# EAGLE schematic Esquemático v2 v3 (EAGLE 9.7.0)
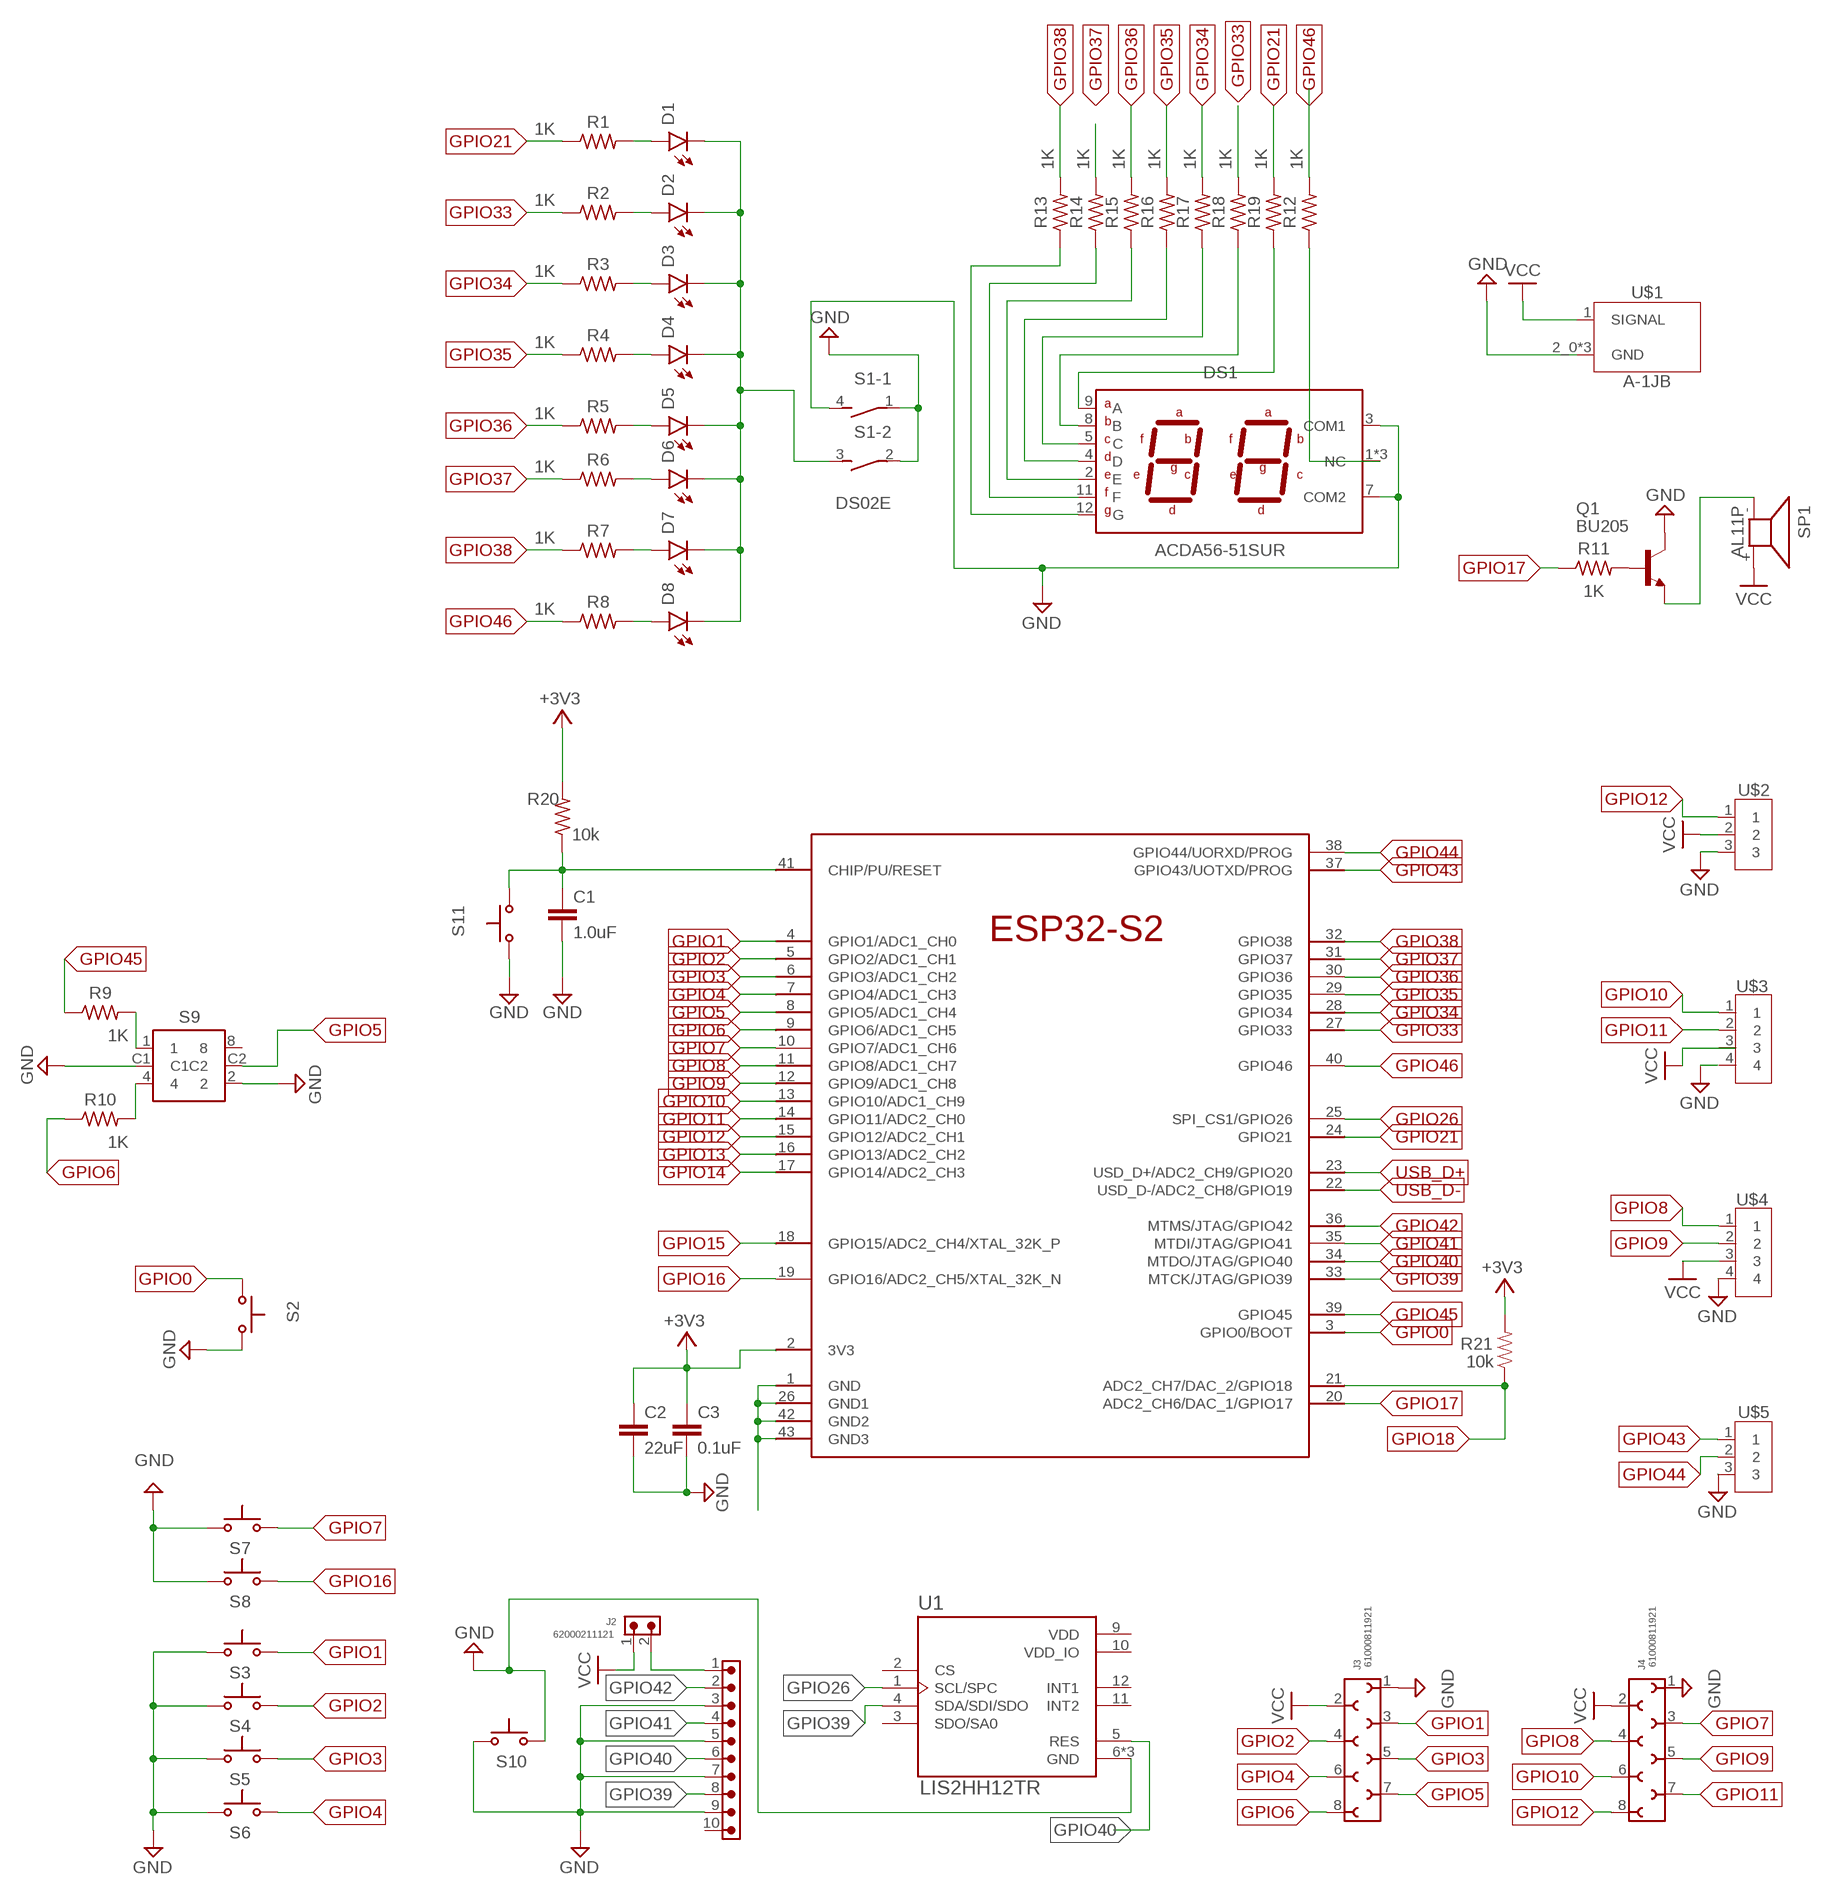
[diagram p0: schematic, sheet 1]

## Parts
C1  1.0uF  1.0UF-0805-25V-10%  [0805]
C2  22uF  22UF-1210-16V-20%  [1210]
C3  0.1uF  0.1UF-0603-100V-10%  [0603]
D1  LED_RADIAL  [LEDRD254W60D565H860B_G]
D2  LED_RADIAL  [LEDRD254W60D565H860B_G]
D3  LED_RADIAL  [LEDRD254W60D565H860B_G]
D4  LED_RADIAL  [LEDRD254W60D565H860B_G]
D5  LED_RADIAL  [LEDRD254W60D565H860B_G]
D6  LED_RADIAL  [LEDRD254W60D565H860B_G]
D7  LED_RADIAL  [LEDRD254W60D565H860B_G]
D8  LED_RADIAL  [LEDRD254W60D565H860B_G]
DS1  ACDA56-51SUR  [ACDA56-51SURKWA]
J1  61901019521  61901019521  [61901019521]
J2  62000211121  6200XX11121_62000211121  [62000211121]
J3  61000811921  6100XX11921_61000811921  [61000811921]
J4  61000811921  6100XX11921_61000811921  [61000811921]
Q1  BU205  [TO3]
R1  1K  R-US_AXIAL-7.2MM-PITCH  [RESAD724W46L381D178B]
R2  1K  R-US_AXIAL-7.2MM-PITCH  [RESAD724W46L381D178B]
R3  1K  R-US_AXIAL-7.2MM-PITCH  [RESAD724W46L381D178B]
R4  1K  R-US_AXIAL-7.2MM-PITCH  [RESAD724W46L381D178B]
R5  1K  R-US_AXIAL-7.2MM-PITCH  [RESAD724W46L381D178B]
R6  1K  R-US_AXIAL-7.2MM-PITCH  [RESAD724W46L381D178B]
R7  1K  R-US_AXIAL-7.2MM-PITCH  [RESAD724W46L381D178B]
R8  1K  R-US_AXIAL-7.2MM-PITCH  [RESAD724W46L381D178B]
R9  1K  R-US_AXIAL-7.2MM-PITCH  [RESAD724W46L381D178B]
R10  1K  R-US_AXIAL-7.2MM-PITCH  [RESAD724W46L381D178B]
R11  1K  R-US_AXIAL-7.2MM-PITCH  [RESAD724W46L381D178B]
R12  1K  R-US_AXIAL-7.2MM-PITCH  [RESAD724W46L381D178B]
R13  1K  R-US_AXIAL-7.2MM-PITCH  [RESAD724W46L381D178B]
R14  1K  R-US_AXIAL-7.2MM-PITCH  [RESAD724W46L381D178B]
R15  1K  R-US_AXIAL-7.2MM-PITCH  [RESAD724W46L381D178B]
R16  1K  R-US_AXIAL-7.2MM-PITCH  [RESAD724W46L381D178B]
R17  1K  R-US_AXIAL-7.2MM-PITCH  [RESAD724W46L381D178B]
R18  1K  R-US_AXIAL-7.2MM-PITCH  [RESAD724W46L381D178B]
R19  1K  R-US_AXIAL-7.2MM-PITCH  [RESAD724W46L381D178B]
R20  10k  R-US_AXIAL-7.2MM-PITCH  [RESAD724W46L381D178B]
R21  10k  10KOHM-0603-1/10W-1%  [0603]
S1  DS02E  [DS-02]
S2  SWITCH-OMRON_B3U-1000P  [SWITCH-OMRON_B3U-1000P]
S3  SWITCH-OMRON_B3U-1000P  [SWITCH-OMRON_B3U-1000P]
S4  SWITCH-OMRON_B3U-1000P  [SWITCH-OMRON_B3U-1000P]
S5  SWITCH-OMRON_B3U-1000P  [SWITCH-OMRON_B3U-1000P]
S6  SWITCH-OMRON_B3U-1000P  [SWITCH-OMRON_B3U-1000P]
S7  SWITCH-OMRON_B3U-1000P  [SWITCH-OMRON_B3U-1000P]
S8  SWITCH-OMRON_B3U-1000P  [SWITCH-OMRON_B3U-1000P]
S9  428521420911  [42852142091X_10POS]
S10  SWITCH-OMRON_B3U-1000P  [SWITCH-OMRON_B3U-1000P]
S11  SWITCH-OMRON_B3U-1000P  [SWITCH-OMRON_B3U-1000P]
SP1  AL11P  [AL11P]
U1  LIS2HH12TR  [LGA-12]
U2  ESP32  [QFN48-0.4MM]
U$1  A-1JB  [A-1JB]
U$2  2828XX-3282837-3  [TERMBLK_508-3N]
U$3  2828XX-4282837-4  [TERMBLK_508-4N]
U$4  2828XX-4282837-4  [TERMBLK_508-4N]
U$5  2828XX-3282837-3  [TERMBLK_508-3N]

## Nets
+3V3: C2.1 C3.1 R20.2 R21.2 U2.2(3V3)
GND: C1.2 C2.2 C3.2 J1.3 J1.5 J1.7 J1.9 J3.1 Q1.C Q1.C/(C) S1.1 S1.2 S2.2(S) S3.1(P) S4.1(P) S5.1(P) S6.1(P) S7.1(P) S8.1(P) S9.2 S9.C1 S10.1(P) S10.2(S) S11.1(P) U1.6(GND) U1.7(GND) U1.8(GND) U2.1(GND) U2.26(GND1) U2.42(GND2) U2.43(GND3) U$1.2_0(GND) U$1.2_1(GND) U$1.2_2(GND) U$2.3 U$5.3
GPIO0: S2.1(P) U2.3(GPIO0/BOOT)
GPIO1: J3.3 S3.2(S) U2.4(GPIO1/ADC1_CH0)
GPIO2: J3.4 S4.2(S) U2.5(GPIO2/ADC1_CH1)
GPIO3: J3.5 S5.2(S) U2.6(GPIO3/ADC1_CH2)
GPIO4: J3.6 S6.2(S) U2.7(GPIO4/ADC1_CH3)
GPIO5: J3.7 S9.C2 U2.8(GPIO5/ADC1_CH4)
GPIO6: J3.8 R10.1 U2.9(GPIO6/ADC1_CH5)
GPIO7: J4.3 S7.2(S) U2.10(GPIO7/ADC1_CH6)
GPIO8: J4.4 U2.11(GPIO8/ADC1_CH7) U$4.1
GPIO9: J4.5 U2.12(GPIO9/ADC1_CH8) U$4.2
GPIO10: J4.6 U2.13(GPIO10/ADC1_CH9) U$3.1
GPIO11: J4.7 U2.14(GPIO11/ADC2_CH0) U$3.2
GPIO12: J4.8 U2.15(GPIO12/ADC2_CH1) U$2.1
GPIO13: U2.16(GPIO13/ADC2_CH2)
GPIO14: U2.17(GPIO14/ADC2_CH3)
GPIO15: U2.18(GPIO15/ADC2_CH4/XTAL_32K_P)
GPIO16: S8.2(S) U2.19(GPIO16/ADC2_CH5/XTAL_32K_N)
GPIO17: R11.1 U2.20(ADC2_CH6/DAC_1/GPIO17)
GPIO18: R21.1 U2.21(ADC2_CH7/DAC_2/GPIO18)
GPIO21: R1.1 R19.2 U2.24(GPIO21)
GPIO26: U1.1(SCL/SPC) U2.25(SPI_CS1/GPIO26)
GPIO33: R2.1 R18.2 U2.27(GPIO33)
GPIO34: R3.1 R17.2 U2.28(GPIO34)
GPIO35: R4.1 R16.2 U2.29(GPIO35)
GPIO36: R5.1 R15.2 U2.30(GPIO36)
GPIO37: R6.1 R14.2 U2.31(GPIO37)
GPIO38: R7.1 R13.2 U2.32(GPIO38)
GPIO39: J1.8 U1.4(SDA/SDI/SDO) U2.33(MTCK/JTAG/GPIO39)
GPIO40: J1.6 U1.5(RES) U2.34(MTDO/JTAG/GPIO40)
GPIO41: J1.4 U2.35(MTDI/JTAG/GPIO41)
GPIO42: J1.2 U2.36(MTMS/JTAG/GPIO42)
GPIO43: U2.37(GPIO43/UOTXD/PROG) U$5.1
GPIO44: U2.38(GPIO44/UORXD/PROG) U$5.2
GPIO45: R9.1 U2.39(GPIO45)
GPIO46: R8.1 R12.2 U2.40(GPIO46)
N$1: Q1.E SP1.-
N$2: DS1.3(COM1) DS1.7(COM2) S1.4 ; supply symbol labelled GND
N$3: D1.1(A) R1.2
N$4: D2.1(A) R2.2
N$5: D3.1(A) R3.2
N$6: D4.1(A) R4.2
N$7: D5.1(A) R5.2
N$8: DS1.9(A) R19.1
N$9: C1.1 R20.1 S11.2(S) U2.41(CHIP/PU/RESET)
N$10: R6.2
N$11: DS1.8(B) R18.1
N$12: D5.2(C) D6.1(A)
N$13: DS1.5(C) R17.1
N$14: DS1.4(D) R16.1
N$15: DS1.2(E) R15.1
N$17: DS1.11(F) R14.1
N$18: DS1.12(G) R13.1
N$19: R9.2 S9.1
N$20: R10.2 S9.4
N$21: DS1.1(NC) DS1.6(NC) DS1.10(NC) R12.1
N$24: Q1.B R11.2
N$33: J1.1 J2.2
N$38: D7.1(A) R7.2
N$39: D8.1(A) R8.2
N$55: D1.2(C) D2.2(C) D3.2(C) D4.2(C) D6.2(C) D7.2(C) D8.2(C) S1.3
USB_D+: U2.23(USD_D+/ADC2_CH9/GPIO20)
USB_D-: U2.22(USD_D-/ADC2_CH8/GPIO19)
VCC: J2.1 J3.2 J4.2 SP1.+ U$1.1(SIGNAL) U$2.2 U$4.3
Unconnected: J1.10 J4.1 S9.8 U1.2(CS) U1.3(SDO/SA0) U1.11(INT2) U1.12(INT1) U$3.3 U$3.4 U$4.4

## Power pins joined to a net without a drawn wire
VDD: U1.9(VDD)
VDD_IO: U1.10(VDD_IO)

## Library data of the parts
C1 = SparkFun-Capacitors:1.0UF: 1µF ceramic capacitors A capacitor is a passive two-terminal electrical component used to store electrical energy temporarily in an electric field.; PROD_ID: CAP-08064; SPICEPREFIX: C
C2 = SparkFun-Capacitors:22UF: 22µF ceramic capacitors A capacitor is a passive two-terminal electrical component used to store electrical energy temporarily in an electric field.; SPICEPREFIX: C
C3 = SparkFun-Capacitors:0.1UF: 0.1µF ceramic capacitors A capacitor is a passive two-terminal electrical component used to store electrical energy temporarily in an electric field.; PROD_ID: CAP-08390
D1-D8 = Library:LED_RADIAL: LED - Generic
DS1 = Display_LED:ACDA56-51SUR: Dual Digit Numeric Display - 7SEG, 0.56" Character size, RED, 10SMD Datasheet <https://www.kingbrightusa.com/images/catalog/SPEC/ACDA56-51SURKWA.pdf>; CATEGORY: DISPLAY; COLOR: Hyper Red (AlGaInP); CONFIGURATION: Common Anode; DESCRIPTION: The Hyper Red source color devices are made with AlGaInP on GaAs substrate Light Emitting Diode; DIGIT: Dual Digit; MANUFACTURER: Kingbright; MPN: ACDA56-51SURKWA; OPERATING_TEMP: -40°C to +85 °C; PART_STATUS: Active; ROHS_COMPLIANT: COMPLIANT; SERIES: -; SUB-CATEGORY: LED; THERMALLOSS: 0.075 W; TYPE: 7-Segment
J1 = Wurth_Connectors_WR-WTB:61901019521: WR-WTB 2.54 mm Male Right Angled Locking Header Top Locking KIND PROPERTIES: Pitch:2.54 mm Gender:Male MATERIAL PROPERTIES: Insulator Material :Nylon 66 Insulator Flammability Rating:UL94 V-0 Insulator Color:Beige Contact Material:Copper Alloy Contact Plating:Tin Contact Type:Stamped GENERAL INFORMATION Operating Temperature:-40 up to +105 °C Compliance: RoHS Working Voltage:250 V (AC) Withstanding Voltage:1000 V (AC) Contact Resistance:20 mΩ RISO:1000 MΩ CERTIFICATION UL Approval:E323964 PACKAGING PROPERTIES Packaging:Bag <https://katalog.we-online.com/media/images/v2/o33347v209%20Family_WR-WTB_6190xx19521.jpg> Details see: https://katalog.we-online.com/en/em/WTB_2_54_MALE_RIGHT_ANGLED_TOP_LOCKING_6190XX19521 Updated by Yingchun,Shan 2019-11-05 2019 (C) Würth Elektronik; CONTACT-RESISTANCE: 20mOhm; DATASHEET-URL: https://www.we-online.com/redexpert/spec/61901019521?ae; GENDER: Male; L: 25.4mm; MOUNT: THT; PACKAGING: Bag; PART-NUMBER: 61901019521; PCB-CABLE-PANEL: PCB; PINS: 10; PITCH: 2.54mm; TYPE: Right Angled Top Locking; WORKING-VOLTAGE: 250V(AC)
J2 = Wurth_Connectors_WR-PHD:6200XX11121_62000211121: WR-PHD 2.00 mm THT Pin Header ARTICLE PROPERTIES: Pins:2;​ 3;​ 4;​ 6;​ 8;​ 10;​ 20;​ 32 KIND PROPERTIES: Pitch：2 mm Quality Class:3 as per CECC 75 301-802 Rows：Single Gender：Pin Header Type：Straight MATERIAL PROPERTIES: Insulator Material :PA9T Insulator Flammability Rating:UL94 V-0 Contact Material:Copper Alloy Contact Plating:Gold Contact Type:Stamped GENERAL INFORMATION Operating Temperature:-40 up to +105 °C Compliance:Lead free / RoHS ELECTRICAL PROPERTIES: Rated Current:max.;​ 2 A IR 1:2A Withstanding Voltage:500 V (AC) Contact Resistance:20 mΩ RISO:1000 MΩ CERTIFICATION UL Approval:E323964 PACKAGING PROPERTIES Packaging:Bag Packaging Unit:1000;​ 500;​ 300;​ 200 <https://katalog.we-online.com/media/images/v2/o33219v209%20Family_WR-PHD_6200xx11121.jpg> Details see: https://katalog.we-online.com/en/em/PHD_2_00_THT_PIN_HEADER_6200XX11121 Updated by Yingchun,Shan 2019-10-24 2019 (C) Würth Elektronik; DATASHEET-URL: https://www.we-online.com/redexpert/spec/62000211121?ae; GENDER: Pin Header; IR: 2A; MOUNT: THT; PACKAGING: Bag; PART-NUMBER: 62000211121; PINS: 2; PITCH: 2.00mm; ROWS: Single; TYPE: Straight
J3 J4 = Wurth_Connectors_WR-PHD:6100XX11921_61000811921: WR-PHD 2.54 mm SMT Socket Header ARTICLE PROPERTIES: Pins:4;​ 5;​ 6;​ 8;​ 10;​ 12;​ 14;​ 16;​ 20;​ 24 KIND PROPERTIES: Pitch：2.54 mm Quality Class:3 as per CECC 75 301-802 Rows：Single Gender：Socket Header Type：Straight Type 1;​ Straight Type 2 MATERIAL PROPERTIES: Insulator Material Nylon 46; PA9T Insulator Flammability Rating:UL94 V-0 Contact Material:Copper Alloy Contact Plating:Gold Contact Type:Stamped GENERAL INFORMATION Operating Temperature:-40 up to +125 °C Compliance:Lead free / RoHS ELECTRICAL PROPERTIES: Rated Current:3 A IR 1:3 A Withstanding Voltage:500 V (AC) Contact Resistance:20 mΩ RISO:1000 MΩ CERTIFICATION UL Approval:E323964 PACKAGING PROPERTIES Packaging:Tube <https://www.we-online.com/catalog/media/o64612v209%20Family_WR-PHD_6100xx13321.jpg> Details see: https://www.we-online.com/katalog/en/em/PHD_2_54_SMT_SOCKET_HEADER_6100XXXXX21 Updated by Ella Wu 2021-12-08 2021 (C) Würth Elektronik; DATASHEET-URL: https://www.we-online.com/redexpert/spec/61000811921?ae; GENDER: Socket Header; IR: 3A; MOUNT: SMT; PACKAGING: Tube; PART-NUMBER: 61000811921; PINS: 8; PITCH: 2.54mm; ROWS: Single; TYPE: Straight Type 1
Q1 = transistor-npn:BU205*: NPN Transistor
R1-R19 = Resistor:R-US: Resistor Fixed - ANSI; CATEGORY: Resistor; SUB-CATEGORY: Fixed
R20 = Resistor:R-US: Resistor Fixed - ANSI; CATEGORY: Resistor; SPICEPREFIX: R; SUB-CATEGORY: Fixed
R21 = SparkFun-Resistors:10KOHM: 10kΩ resistor A resistor is a passive two-terminal electrical component that implements electrical resistance as a circuit element. Resistors act to reduce current flow, and, at the same time, act to lower voltage levels within circuits. - Wikipedia; PROD_ID: RES-00824; SPICEPREFIX: R
S1 = Switch:DS02E: DIL/CODE SWITCH; CATEGORY: SWITCH; TYPE: SPST
S2-S8 S10 S11 = 52101-101-REV-A_v16:SWITCH-OMRON_B3U-1000P: SMD Tactile Switch - Ultra Small
S9 = Wurth_Switch_WS-ROSV:428521420911: WS-ROSV SMT Rotary Switch with Arrow Type Actuator 10x10 mm Material Properties Cover Material : LCP Packaging Properties Packaging :Tube Electrical Properties IR 1 :150 mA Properties Cover Flammability Rating:UL94 V-0 Actuator Material:LCP Actuator Flammability Rating:UL94 V-0 Actuator Color:Blue; Light Grey Base Material:LCP Base Flammability Rating:UL94 V-0 Terminal Plating:Gold Actuator Type:Shaft Type Washable:Yes Additional VR：24 V (DC) Mechanical Properties Electrical Life：10000 Steps Actuator Type：Shaft Type Code：Complement Code; Real Code General Information Operating Temperature:-40 up to +85 °C Tableadditional Actuator Type：Shaft Type Washable：Yes <https://www.we-online.com/catalog/media/o41283v209%20WS-ROSV_10x10.jpg> Details see: https://www.we-online.com/catalog/en/ROSV_10X10_WASHABLE_SMD_SHAFT_TYPE/ Updated by yingchun,Shan;2020-02-24 2020(C) Würth Elektronik; DATASHEET-URL: https://www.we-online.com/catalog/datasheet/428521420911.pdf; NUMBER-OF-POSITION: 10; PART-NUMBER: 428521420911; QTY: 600
SP1 = buzzer:AL11P: SPEAKER Source: Buerklin; OC_FARNELL: unknown; OC_NEWARK: unknown
U1 = Sensor:LIS2HH12TR: ACCELEROMETER 2-8G I2C/SPI 12LGA Manufacturer's datasheet <https://www.st.com/content/ccc/resource/technical/document/datasheet/c9/16/f2/79/ca/31/47/89/DM00096789.pdf/files/DM00096789.pdf/jcr:content/translations/en.DM00096789.pdf>; CREATED_BY: PCBLayout.com; DIGIKEY_PN: 497-15069-2-ND; MANUFACTURER: STMicroelectronics; MPN: LIS2HH12TR; PACKAGE: LGA-12
U2 = Biblioteca ESP32-S2:ESP32: Espressif ESP32 WiFi-compatible SoC microcontroller. Bluetooth Low energy support (BLE, BT4.0, Bluetooth Smart) 28 GPIO pins Dual-core Tensilica LX6 microprocessor Hardware accelerated encryption (AES, SHA2, ECC, RSA-4096) 4MB Flash memory 520kB internal SRAM Datasheet <https://cdn.sparkfun.com/datasheets/IoT/esp32_datasheet_en.pdf> SparkFun Products: SparkFun ESP32 Thing <https://www.sparkfun.com/products/13907>; PROD_ID: IC-13338; SPICEPREFIX: X
U$1 = Connector:A-1JB: U.FL (UMCC), AMC Connector Jack, Male Pin 50Ohm Surface Mount Solder Datasheet <https://www.amphenolrf.com/library/download/link/link_id/584922/parent/A-1JB/>; CATEGORY: Connector; DESCRIPTION: U.FL (UMCC), AMC Connector Jack, Male Pin 50Ohm Surface Mount Solder; MANUFACTURER: Amphenol RF; MPN: A-1JB; OPERATING_TEMPERATURE: 40°C TO +90°C; PART_STATUS: Active; ROHS_COMPLIANCE: RoHS Compliant; SERIES: AMC; TYPE: Coaxial Connector (RF)
U$2 U$5 = Connector:2828XX-3: 3 Position Wire to Board Terminal Block Horizontal with Board Datasheet <https://www.te.com.cn/commerce/DocumentDelivery/DDEController?Action=showdoc&DocId=Catalog+Section%7F1308389_EUROSTYLE_TERMINAL_BLOCKS%7F0607%7Fpdf%7FEnglish%7FENG_CS_1308389_EUROSTYLE_TERMINAL_BLOCKS_0607.pdf%7F2-282837-5>; CATEGORY: Connector; DESCRIPTION: TERM BLK 3P SIDE ENT 5.08mm PCB; MANUFACTURER: TE Connectivity; MPN: 282837-3; OPERATING_TEMPERATURE: -40°C to +105°C; PART_STATUS: Active; ROHS_COMPLIANCE: RoHS Compliant; SERIES: 282837; SUBCATEGORY: Terminal Block; TYPE: Side Wire Entry
U$3 U$4 = Connector:2828XX-4: 4 Position Wire to Board Terminal Block Horizontal with Board Datasheet <https://www.te.com.cn/commerce/DocumentDelivery/DDEController?Action=showdoc&DocId=Catalog+Section%7F1308389_EUROSTYLE_TERMINAL_BLOCKS%7F0607%7Fpdf%7FEnglish%7FENG_CS_1308389_EUROSTYLE_TERMINAL_BLOCKS_0607.pdf%7F2-282837-5>; CATEGORY: Connector; DESCRIPTION: TERM BLK 4P SIDE ENT 5.08mm PCB; MANUFACTURER: TE Connectivity; MPN: 282837-4; OPERATING_TEMPERATURE: 40°C to +105°C; PART_STATUS: Active; ROHS_COMPLIANCE: RoHS Compliant; SERIES: 283737; SUBCATEGORY: Terminal Block; TYPE: Side Wire Entry